# EAGLE design Token2 (EAGLE 9.6.2)
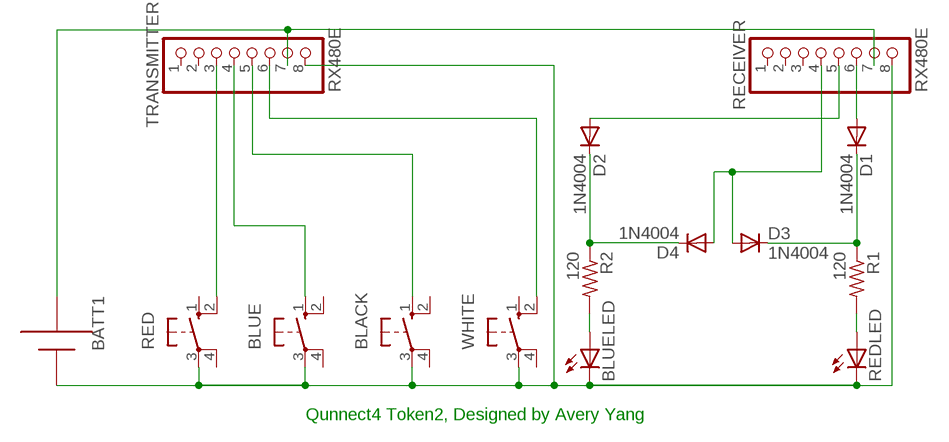
[diagram p0: schematic, sheet 1]

## Parts
BATT1  AAA  [12BH412]
BLACK  10-XX  [B3F-10XX]
BLUE  10-XX  [B3F-10XX]
BLUELED  LED5MM  [LED5MM]
D1  1N4004  [DO41-10]
D2  1N4004  [DO41-10]
D3  1N4004  [DO41-10]
D4  1N4004  [DO41-10]
R1  120  R-US_0207/10  [0207/10]
R2  120  R-US_0207/10  [0207/10]
RECEIVER  RX480E  PINHD-1X8  [1X08]
RED  10-XX  [B3F-10XX]
REDLED  LED5MM  [LED5MM]
TRANSMITTER  RX480E  PINHD-1X8  [1X08]
WHITE  10-XX  [B3F-10XX]

## Nets
N$1: BATT1.+ BLACK.3(P) BLUE.3(P) BLUELED.K(C) RECEIVER.8 RED.3(P) REDLED.K(C) TRANSMITTER.8 WHITE.3(P)
N$2: D2.C D4.C R2.1
N$3: TRANSMITTER.6 WHITE.2(S1)
N$4: BLUE.1(S) TRANSMITTER.4
N$5: RED.2(S1) TRANSMITTER.3
N$6: BLACK.1(S) TRANSMITTER.5
N$7: D2.A RECEIVER.5
N$8: D1.A RECEIVER.6
N$10: D1.C D3.C R1.1
N$11: R1.2 REDLED.A
N$12: BLUELED.A R2.2
N$13: D3.A D4.A RECEIVER.4
N$14: BATT1.- RECEIVER.7 TRANSMITTER.7
Unconnected: BLACK.2(S1) BLACK.4(P1) BLUE.2(S1) BLUE.4(P1) RECEIVER.1 RECEIVER.2 RECEIVER.3 RED.1(S) RED.4(P1) TRANSMITTER.1 TRANSMITTER.2 WHITE.1(S) WHITE.4(P1)

## Notes on the sheet
- Qunnect4 Token2, Designed by Avery Yang

## Library data of the parts
BATT1 = adafruit:AAA: AAA PC pin holder Mouser part #12BH412 - but pretty much any 1x AAA battery holder should be the same http://www.ladyada.net/library/pcb/eaglelibrary.html
BLACK BLUE RED WHITE = switch-omron:10-XX: OMRON SWITCH; MPN: B3F-1000; OC_FARNELL: 176432; OC_NEWARK: 36M3542
BLUELED REDLED = adafruit:LED: LED OSRAM: - CHIPLED LG R971, LG N971, LY N971, LG Q971, LY Q971, LO R971, LY R971 LH N974, LH R974 LS Q976, LO Q976, LY Q976 LO Q996 - Hyper CHIPLED LW Q18S LB Q993, LB Q99A, LB R99A - SideLED LS A670, LO A670, LY A670, LG A670, LP A670 LB A673, LV A673, LT A673, LW A673 LH A674 LY A675 LS A676, LA A676, LO A676, LY A676, LW A676 LS A679, LY A679, LG A679 - Hyper Micro SIDELED® LS Y876, LA Y876, LO Y876, LY Y876 LT Y87S - SmartLED LW L88C, LW L88S LB L89C, LB L89S, LG L890 LS L89K, LO L89K, LY L89K LS L896, LA L896, LO L896, LY L896 - TOPLED LS T670, LO T670, LY T670, LG T670, LP T670 LSG T670, LSP T670, LSY T670, LOP T670, LYG T670 LG T671, LOG T671, LSG T671 LB T673, LV T673, LT T673, LW T673 LH T674 LS T676, LA T676, LO T676, LY T676, LB T676, LH T676, LSB T676, LW T676 LB T67C, LV T67C, LT T67C, LS T67K, LO T67K, LY T67K, LW E67C LS E67B, LA E67B, LO E67B, LY E67B, LB E67C, LV E67C, LT E67C LW T67C LS T679, LY T679, LG T679 LS T770, LO T770, LY T770, LG T770, LP T770 LB T773, LV T773, LT T773, LW T773 LH T774 LS E675, LA E675, LY E675, LS T675 LS T776, LA T776, LO T776, LY T776, LB T776 LHGB T686 LT T68C, LB T68C - Hyper Mini TOPLED® LB M676 - Mini TOPLED Santana® LG M470 LS M47K, LO M47K, LY M47K Source: http://www.osram.convergy.de/
D1-D4 = adafruit:1N4004: DIODE General purpose 1N400x type rectifier (With bigger pads) http://www.ladyada.net/library/pcb/eaglelibrary.html
R1 R2 = adafruit:R-US_: RESISTOR, American symbol
RECEIVER TRANSMITTER = pinhead:PINHD-1X8: PIN HEADER

## Board
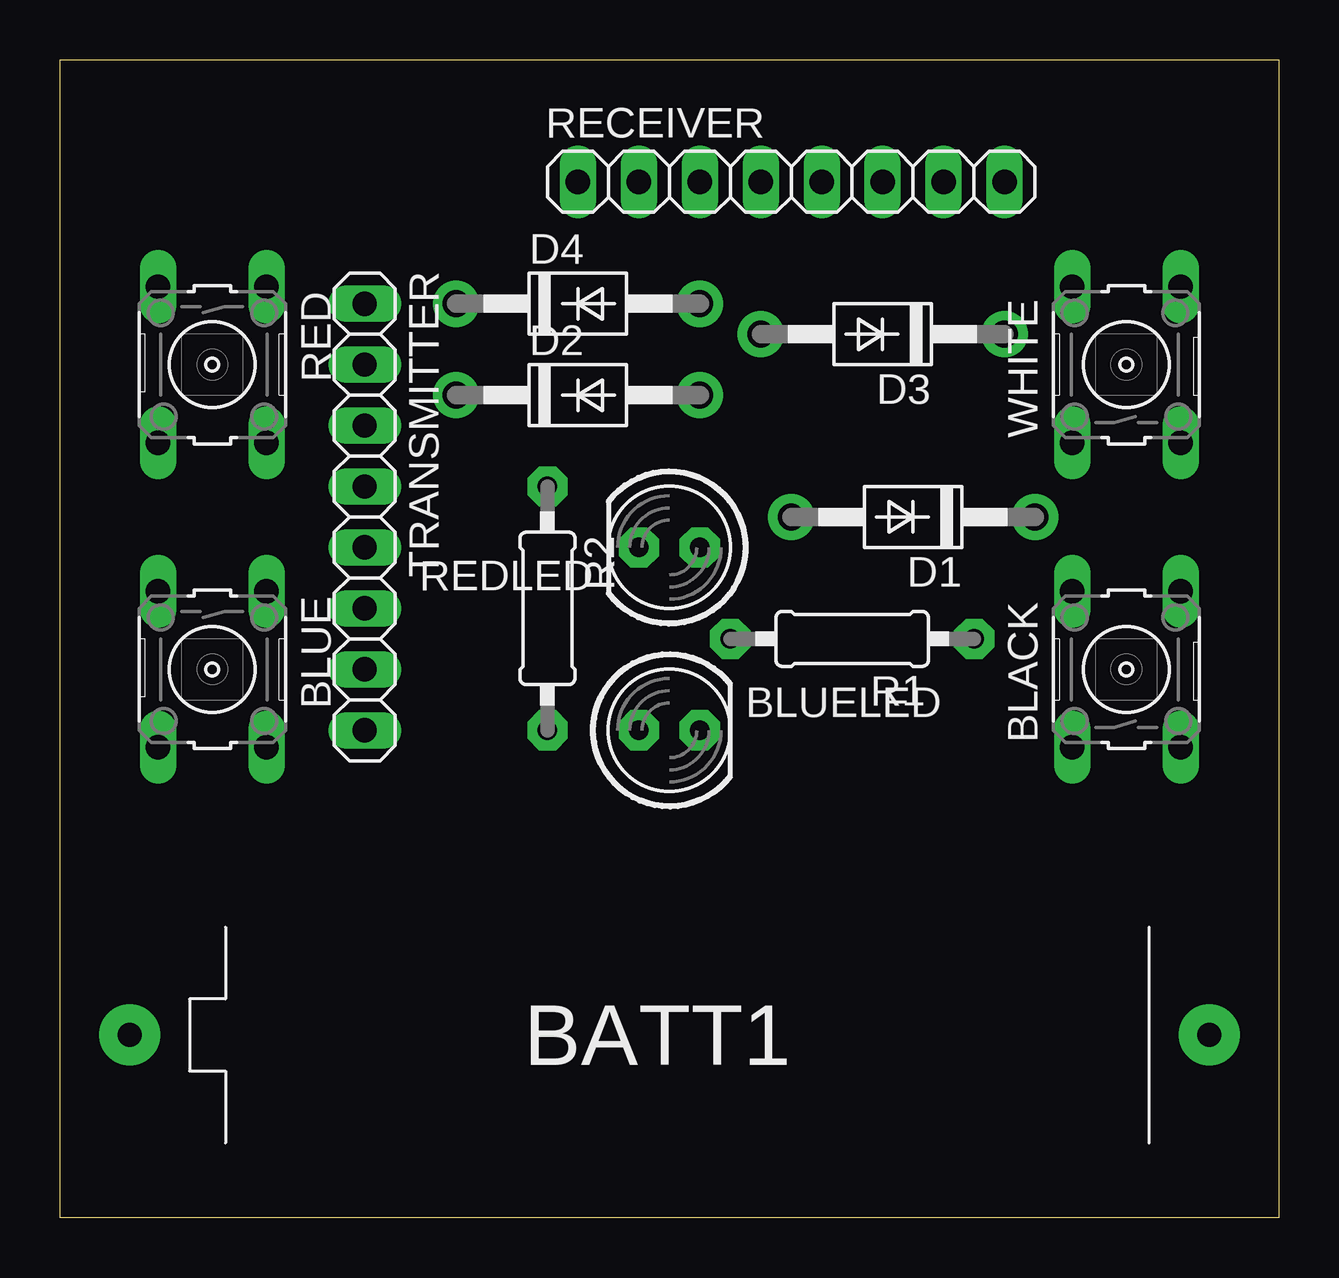
[diagram p1: board, top side]
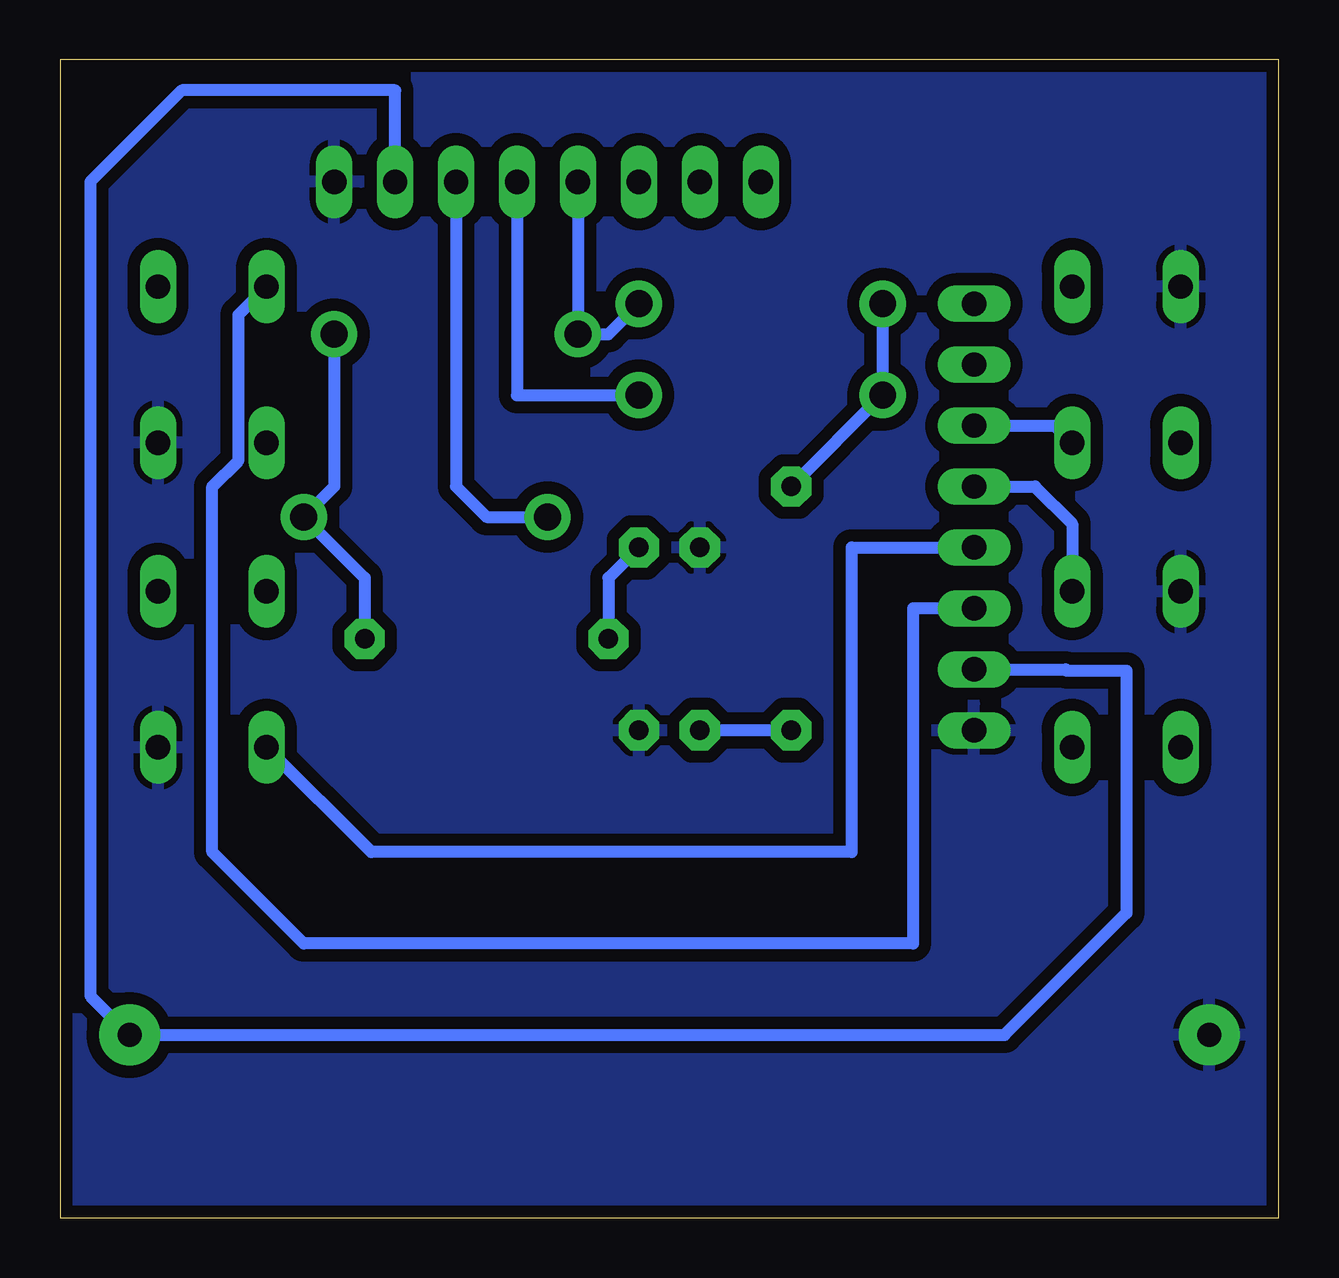
[diagram p2: board, bottom side, seen from below]

Size 50.8 x 48.26 mm. Coordinates in mm from the lower left corner, seen from the top.
Outline: 0,0 0,48.26 50.8,48.26 50.8,0 0,0
Copper layers (1*16): Top 0.035mm / dielectric 1.5mm / Bottom 0.035mm
Design rules "default *": minimum track width 6mil, minimum drill 0.35mm, track to track 6mil, track to pad 6mil, pad to pad 6mil, via to via 6mil, smd to smd 6mil, copper to edge 6mil, drill to drill 6mil, minimum pad ring 10mil, minimum via ring 8mil, stop-mask expansion 4mil, vias tented up to drill 0mil, thermal gap 10mil

### Footprints (pad centres in the part's own frame; a part is rotated, then mirrored left to right if it is on the bottom)
12BH412 = drill 1 pad 2.54: + 22.5,0; - -22.5,0
B3F-10XX = drill 1.016 long: 1 -3.251,2.261; 2 3.251,2.261; 3 -3.251,-2.261; 4 3.251,-2.261
LED5MM = drill 0.813 pad 1.676 octagon: A -1.27,0; K 1.27,0
DO41-10 = drill 1.118 pad 1.93: A 5.08,0; C -5.08,0
0207/10 = drill 0.813 pad 1.676 octagon: 1 -5.08,0; 2 5.08,0
1X08 = drill 1.016 long: 1 -8.89,0; 2 -6.35,0; 3 -3.81,0; 4 -1.27,0; 5 1.27,0; 6 3.81,0; 7 6.35,0; 8 8.89,0

### Placement (x,y rotation side)
BATT1  25.4,7.62 180 top
BLACK  44.45,22.86 90 top
BLUE  6.35,22.86 270 top
BLUELED  25.4,20.32 0 top
D1  35.56,29.21 180 top
D2  21.59,34.29 0 top
D3  34.29,36.83 180 top
D4  21.59,38.1 0 top
R1  33.02,24.13 180 top
R2  20.32,25.4 270 top
RECEIVER  30.48,43.18 0 top
RED  6.35,35.56 270 top
REDLED  25.4,27.94 180 top
TRANSMITTER  12.7,29.21 270 top
WHITE  44.45,35.56 90 top

### Tracks (layer width: path | path; a pad name or v marks a point on that pad's centre or on a via)
N$1
  pour Bottom (isolate 0.508): -1.27,49.53 -1.27,-1.27 52.07,-1.27 52.07,49.53
N$2
  Bottom 0.508: D4.C D2.C R2.1
N$3
  Bottom 0.508: TRANSMITTER.6 15.24,25.4 15.24,11.43 40.64,11.43 44.45,15.24 44.45,30.48 43.36,31.57 43.36,37.64 WHITE.2
N$4
  Bottom 0.508: TRANSMITTER.4 10.16,30.48 8.61,28.93 BLUE.1
N$5
  Bottom 0.508: RED.2 9.32,33.02 TRANSMITTER.3
N$6
  Bottom 0.508: TRANSMITTER.5 17.8,27.94 17.8,15.24 37.82,15.24 BLACK.1
N$7
  Bottom 0.508: RECEIVER.5 31.75,34.29 D2.A
N$8
  Bottom 0.508: RECEIVER.6 34.29,30.48 33.02,29.21 D1.A
N$10
  Bottom 0.508: D3.C 39.37,30.48 D1.C 38.1,26.67 R1.1
N$11
  Bottom 0.508: REDLED.A 27.94,26.67 R1.2
N$12
  Bottom 0.508: R2.2 BLUELED.A
N$13
  Bottom 0.508: D4.A 27.94,36.83 D3.A RECEIVER.4
N$14
  Bottom 0.508: TRANSMITTER.7 8.89,22.86 8.84,22.81 6.35,22.81 6.35,12.7 11.43,7.62 BATT1.- 49.53,9.25 49.53,43.18 45.72,46.99 36.83,46.99 RECEIVER.7